# Altium schematic sheet IO.SchDoc
size A4
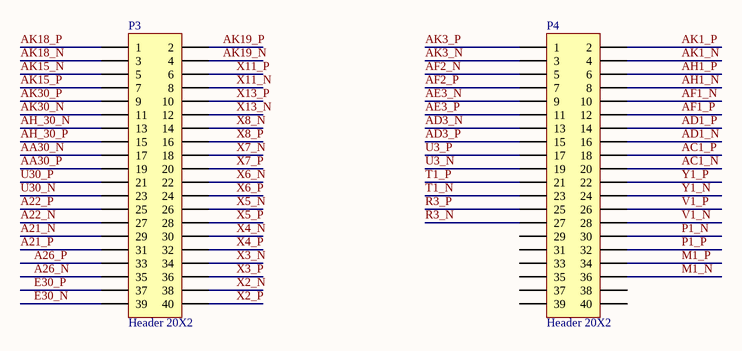
[diagram p0: IO.SchDoc]

## Parts
P3  Header 20X2  [HDR2X20]
P4  Header 20X2  [HDR2X20]

## Nets
A21_N: P3.29
A21_P: P3.31
A22_N: P3.27
A22_P: P3.25
A26_N: P3.35
A26_P: P3.33
AA30_N: P3.17
AA30_P: P3.19
AC1_N: P4.20
AC1_P: P4.18
AD1_N: P4.16
AD1_P: P4.14
AD3_N: P4.13
AD3_P: P4.15
AE3_N: P4.9
AE3_P: P4.11
AF1_N: P4.10
AF1_P: P4.12
AF2_N: P4.5
AF2_P: P4.7
AH1_N: P4.8
AH1_P: P4.6
AH_30_N: P3.13
AH_30_P: P3.15
AK1_N: P4.4
AK1_P: P4.2
AK3_N: P4.3
AK3_P: P4.1
AK15_N: P3.5
AK15_P: P3.7
AK18_N: P3.3
AK18_P: P3.1
AK19_N: P3.4
AK19_P: P3.2
AK30_N: P3.11
AK30_P: P3.9
E30_N: P3.39
E30_P: P3.37
M1_N: P4.36
M1_P: P4.34
P1_N: P4.30
P1_P: P4.32
R3_N: P4.27
R3_P: P4.25
T1_N: P4.23
T1_P: P4.21
U3_N: P4.19
U3_P: P4.17
U30_N: P3.23
U30_P: P3.21
V1_N: P4.28
V1_P: P4.26
X2_N: P3.38
X2_P: P3.40
X3_N: P3.34
X3_P: P3.36
X4_N: P3.30
X4_P: P3.32
X5_N: P3.26
X5_P: P3.28
X6_N: P3.22
X6_P: P3.24
X7_N: P3.18
X7_P: P3.20
X8_N: P3.14
X8_P: P3.16
X11_N: P3.8
X11_P: P3.6
X13_N: P3.12
X13_P: P3.10
Y1_N: P4.24
Y1_P: P4.22

Not connected (* = marked no-connect by the designer): P4 29 31 33 35 37 38 39 40

## Library data of the parts
P3 P4 = Header 20X2: Header, 20-Pin, Dual row; LatestRevisionDate: 17-Jul-2002; LatestRevisionNote: Re-released for DXP Platform.; Publisher: Altium Limited